# EAGLE design minishiled_smd (EAGLE 6.1)
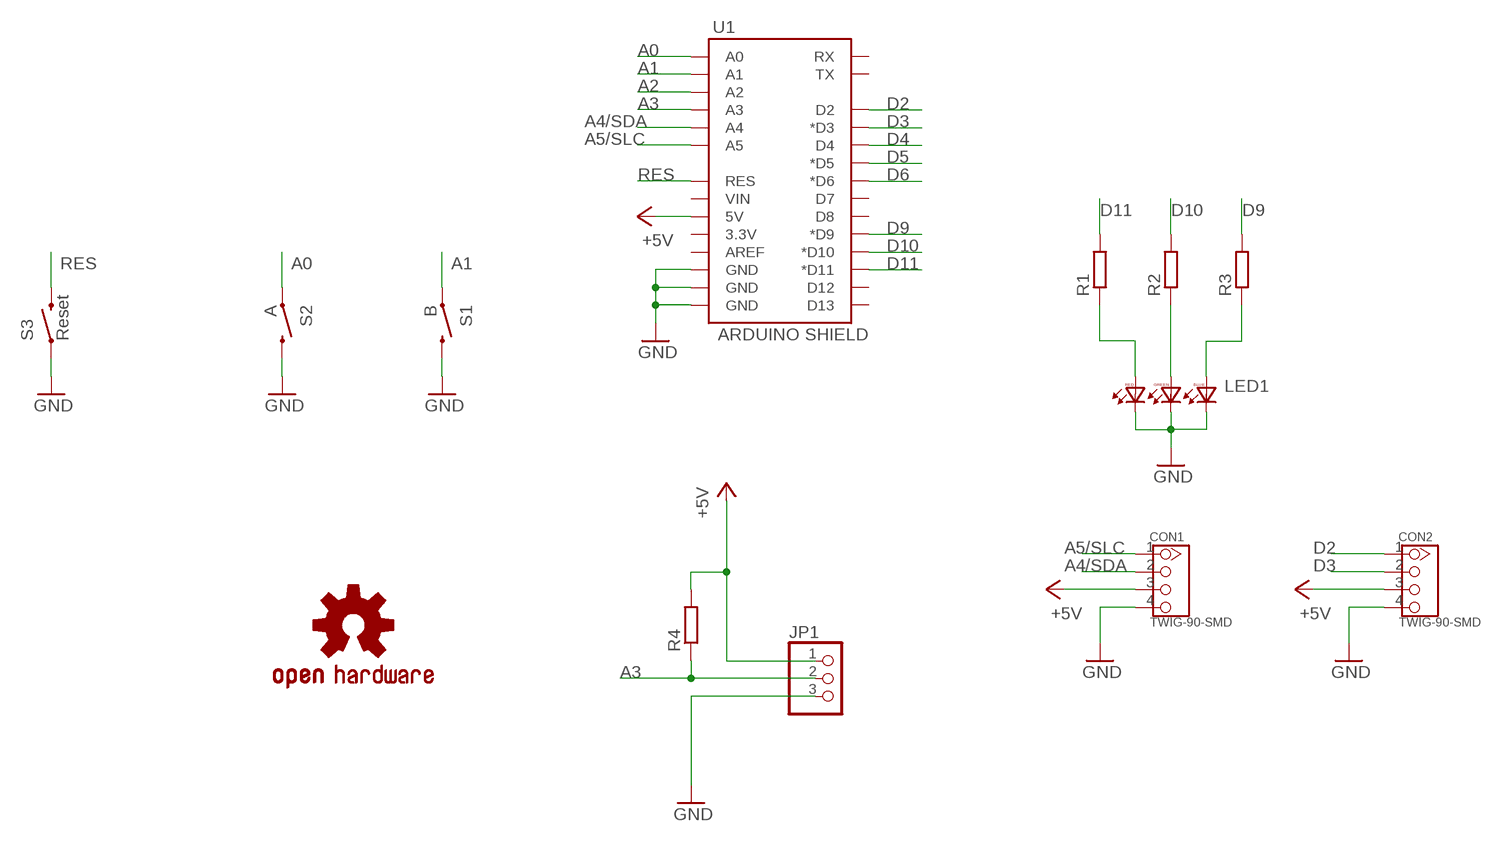
[diagram p0: schematic, sheet 1]

## Parts
CON1  TWIG-90-SMD  [TWIG-90-SMD]
CON2  TWIG-90-SMD  [TWIG-90-SMD]
JP1  PINHD-1X3  [1X03]
LED1  LED-RGB-PLCC6  [PLCC6-RAW]
R1  R-EU_R1206  [R1206]
R2  R-EU_R1206  [R1206]
R3  R-EU_R1206  [R1206]
R4  R-EU_R1206  [R1206]
S1  B  SWITCH-MOMENTARY-2  [TACTILE_SWITCH_TALL]
S2  A  SWITCH-MOMENTARY-2  [TACTILE_SWITCH_TALL]
S3  Reset  SWITCH-MOMENTARY-2-SMD-1101NE  [TACTILE-SWITCH-1101NE]
U1  ARDUINO SHIELD  ARDUINO_SHIELDNO_SILK  [DUEMILANOVE_VIAS]
U$1  LOGO-OSH  [LOGO-OSH]

## Nets
+5V: CON1.3 CON2.3 JP1.1 R4.2 U1.5V
A0: S2.A2 U1.A0
A1: S1.A2 U1.A1
A2: U1.A2
A3: JP1.2 R4.1 U1.A3
A4/SDA: CON1.2 U1.A4
A5/SLC: CON1.1 U1.A5
D2: CON2.1 U1.D2
D3: CON2.2 U1.D3(*D3)
D4: U1.D4
D5: U1.D5(*D5)
D6: U1.D6(*D6)
D9: R3.2 U1.D9(*D9)
D10: R2.2 U1.D10(*D10)
D11: R1.2 U1.D11(*D11)
GND: CON1.4 CON2.4 JP1.3 LED1.4(BC) LED1.5(GC) LED1.6(RC) S1.B2 S2.B2 S3.P$1 U1.GND@0(GND) U1.GND@1(GND) U1.GND@2(GND)
N$5: LED1.3(RA) R1.1
N$6: LED1.2(GA) R2.1
N$7: LED1.1(BA) R3.1
RES: S3.P$2 U1.RES
Unconnected: U1.3.3V U1.AREF U1.D7 U1.D8 U1.D12 U1.D13 U1.RX U1.TX U1.VIN

## Library data of the parts
CON1 CON2 = misc:TWIG-90-SMD
JP1 = pinhead:PINHD-1X3: PIN HEADER
LED1 = misc:LED-RGB-PLCC6
R1-R4 = rcl:R-EU_: RESISTOR, European symbol
S1-S3 = SparkFun-Electromechanical:SWITCH-MOMENTARY-2: Various NO switches- pushbuttons, reed, etc
U1 = SparkFun-Boards:ARDUINO_SHIELD: Arduino shield footprint
U$1 = misc:LOGO-OSH

## Board
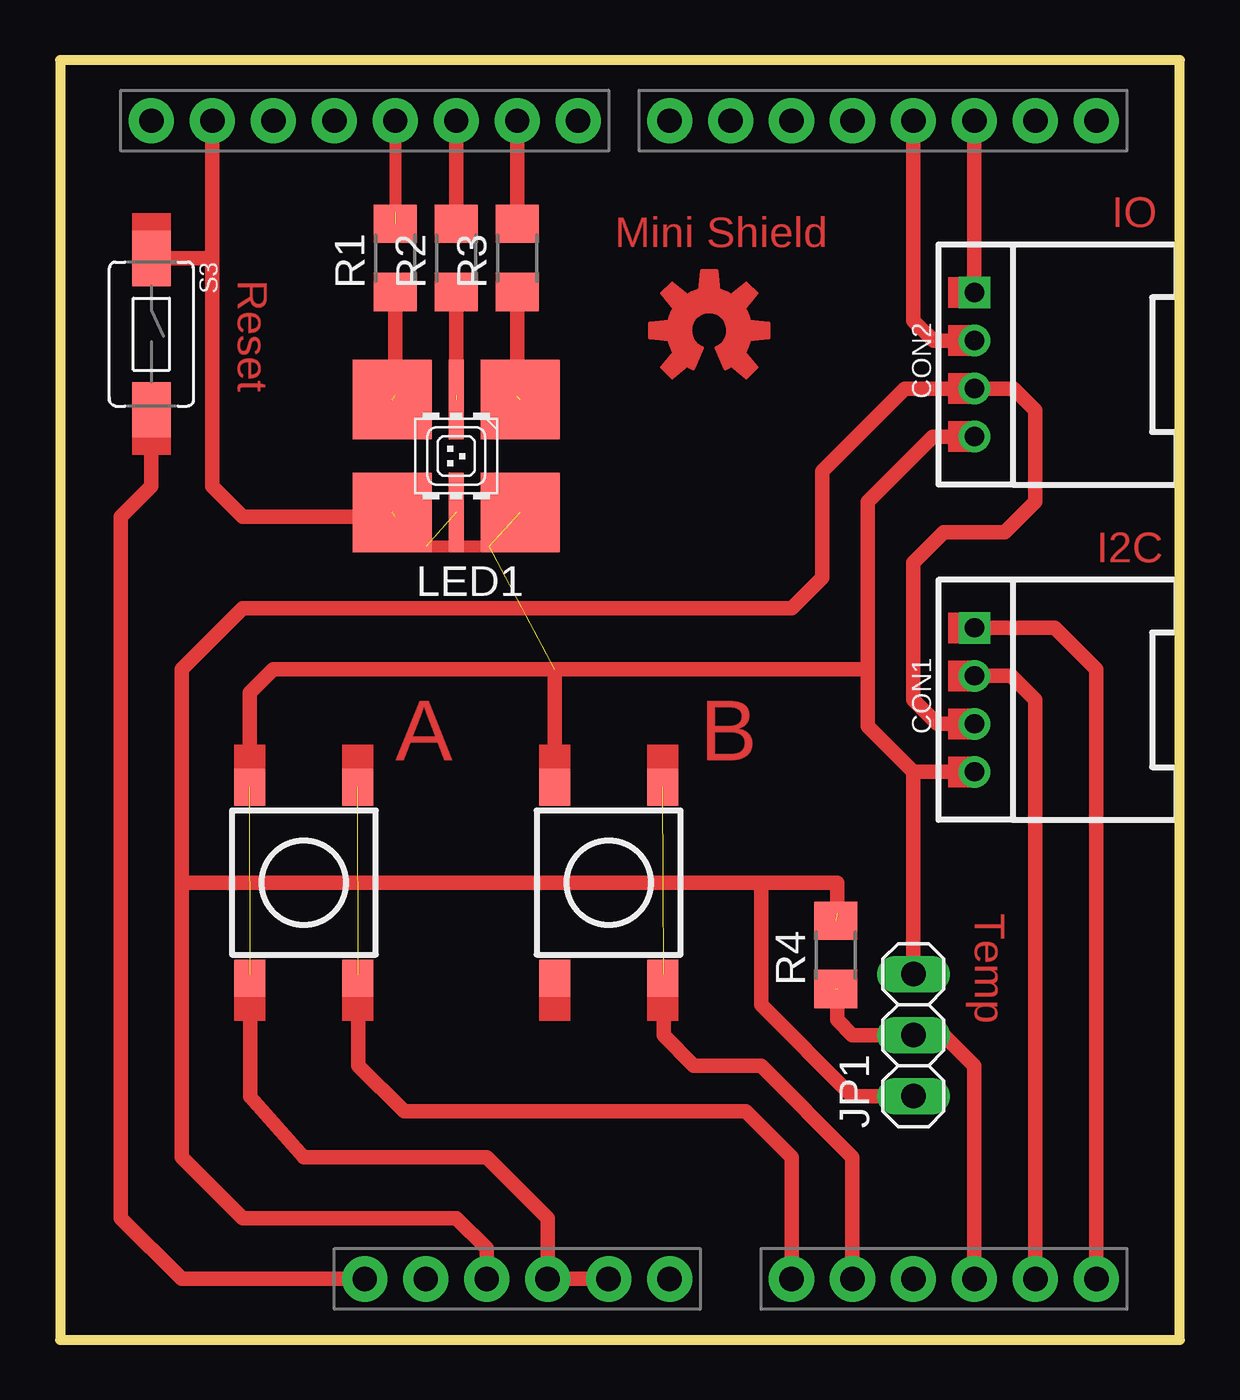
[diagram p1: board, top side]

Size 46.66 x 53.33 mm. Coordinates in mm from the lower left corner, seen from the top.
Outline: 0,0 46.66,0 46.66,53.33 0,53.33 0,0
Copper layers (1*16): Top 0.035mm / dielectric 1.5mm / Bottom 0.035mm
Design rules: minimum track width 10mil, minimum drill 24mil, track to track 8mil, track to pad 8mil, pad to pad 8mil, via to via 8mil, smd to smd 8mil, copper to edge 40mil, drill to drill 8mil, minimum pad ring 10mil, minimum via ring 8mil, stop-mask expansion 4mil, vias tented up to drill 0mil, thermal gap 10mil

### Footprints (pad centres in the part's own frame; a part is rotated, then mirrored left to right if it is on the bottom)
TWIG-90-SMD = drill 0.8 pad 1.27 square: 1 -3,-3.81 | drill 0.8 pad 1.27: 2 -1,-3.81; 3 1,-3.81; 4 3,-3.81
1X03 = drill 1.016 long: 1 -2.54,0; 2 0,0; 3 2.54,0
PLCC6-RAW = smd 3.302 x 3.302: 1 -2.667,-2.349; 3 2.667,-2.349; 4 2.667,2.349; 6 -2.667,2.349 | smd 0.61 x 3.302: 2 0,-2.349; 5 0,2.349
R1206 = smd 1.6 x 1.803: 1 -1.422,0; 2 1.422,0
TACTILE_SWITCH_TALL = smd 1.55 x 1.3: A1 -3.975,-2.25; A2 3.975,-2.25; B1 -3.975,2.25; B2 3.975,2.25
TACTILE-SWITCH-1101NE = smd 2.3 x 1.6: P$1 -3.15,0; P$2 3.15,0
DUEMILANOVE_VIAS = drill 1.016 pad 1.88: 3.3V 50.8,13.97; 5V 50.8,16.51; A0 50.8,29.21; A1 50.8,31.75; A2 50.8,34.29; A3 50.8,36.83; A4 50.8,39.37; A5 50.8,41.91; AREF 2.54,2.54; D2 2.54,36.83; D3 2.54,34.29; D4 2.54,31.75; D5 2.54,29.21; D6 2.54,26.67; D7 2.54,24.13; D8 2.54,20.32; D9 2.54,17.78; D10 2.54,15.24; D11 2.54,12.7; D12 2.54,10.16; D13 2.54,7.62; GND@0 50.8,19.05; GND@1 50.8,21.59; GND@2 2.54,5.08; RES 50.8,11.43; RX 2.54,41.91; TX 2.54,39.37; VIN 50.8,24.13

### Placement (x,y rotation side)
CON1  41.91,26.67 270 top
CON2  41.91,40.64 270 top
JP1  35.56,12.7 90 top
LED1  16.51,36.83 180 top
R1  13.97,45.09 90 top
R2  16.51,45.09 90 top
R3  19.05,45.09 90 top
R4  32.33,16.04 90 top
S1  22.86,19.05 90 top
S2  10.16,19.05 90 top
S3  3.81,41.91 270 top
U1  1.27,53.34 270 top
U$1  27.05,42.06 0 top

### Tracks (layer width: path | path; a pad name or v marks a point on that pad's centre or on a via)
+5V  (1 unrouted)
  Top 0.61: 5.08,19.05 5.08,7.62 7.62,5.08 16.51,5.08 17.78,3.81 U1.5V | 5.08,19.05 5.08,27.94 7.62,30.48 30.48,30.48 31.75,31.75 31.75,36.2 35.2,39.64 CON2.3 39.74,39.64 40.64,38.73 40.64,34.92 39.37,33.66 36.83,33.66 35.56,32.38 35.56,26.67 36.56,25.67 CON1.3 | 29.21,19.05 5.08,19.05 | 29.21,19.05 29.21,13.97 33.02,10.16 JP1.1 | 29.21,19.05 32.38,19.05 32.38,17.78
A0  (1 unrouted)
  Top 0.61: U1.A0 30.48,7.62 28.57,9.53 14.35,9.53 12.42,11.43 12.42,15.24
A1  (1 unrouted)
  Top 0.61: U1.A1 33.02,7.62 29.21,11.43 26.42,11.43 25.15,12.7 25.15,15.24
A3  (1 unrouted)
  Top 0.61: U1.A3 38.1,11.43 36.83,12.7 JP1.2 33.02,12.7 32.38,13.34 32.38,14.61
A4/SDA
  Top 0.61: U1.A4 40.64,26.67 39.64,27.67 CON1.2
A5/SLC
  Top 0.61: U1.A5 43.18,27.94 41.45,29.67 CON1.1
D2
  Top 0.61: CON2.1 U1.D2
D3  (1 unrouted)
  Top 0.61: CON2.2 36.4,41.63 35.56,42.47 U1.D3
D9
  Top 0.61: U1.D9 R3.2
D10
  Top 0.61: U1.D10 R2.2
D11  (1 unrouted)
  Top 0.508: U1.D11 13.97,46.99
GND  (5 unrouted)
  Top 0.508: LED1.4 15.25,33.07 17.88,33.07
  Top 0.61: U1.GND@1 U1.GND@0 20.32,5.08 17.78,7.62 10.16,7.62 7.93,10.13 7.93,15.21 | 35.56,23.67 JP1.3 | 33.66,27.94 33.66,34.92 36.37,37.64 CON2.4 | 33.66,27.94 33.66,25.57 35.56,23.67 | S2.B2 7.91,26.96 8.89,27.94 20.61,27.94 | 20.61,27.94 33.66,27.94 | S1.B2 20.61,27.94 | U1.GND@2 6.35,45.06 | 6.35,45.06 6.35,35.56 7.62,34.29 13.97,34.29 | S3.P$1 6.35,45.06 | CON1.4 35.56,23.67
N$1  (via drill 0.5 pad 1.42)  (2 unrouted)
  other vias: 3.81,50.8 6.35,50.8 8.89,50.8 11.43,50.8 13.97,50.8 16.51,50.8 19.05,50.8 21.59,50.8 25.4,50.8 27.94,50.8 30.48,50.8 33.02,50.8 35.56,50.8 38.1,50.8 40.64,50.8 43.18,50.8 12.7,2.54 15.24,2.54 17.78,2.54 20.32,2.54 22.86,2.54 25.4,2.54 30.48,2.54 35.56,2.54 33.02,2.54 38.1,2.54 40.64,2.54 43.18,2.54 35.56,15.24 35.56,12.7 35.56,10.16
N$5  (1 unrouted)
  Top 0.61: R1.1 13.97,39.37
N$6  (1 unrouted)
  Top 0.61: R2.1 16.51,39.37
N$7  (1 unrouted)
  Top 0.61: R3.1 19.05,39.31
RES
  Top 0.61: U1.RES 5.08,2.54 2.54,5.08 2.54,34.29 3.81,35.56 S3.P$2
(copper drawn outside any net)
  shapes: Top area x10

### Text on the board
Top: Mini Shield | IO | Reset | I2C | A | B | Temp